# Altium schematic sheet CAN.SchDoc: Radio Pod - CANBUS
size A4; Author: Jonn Dillon
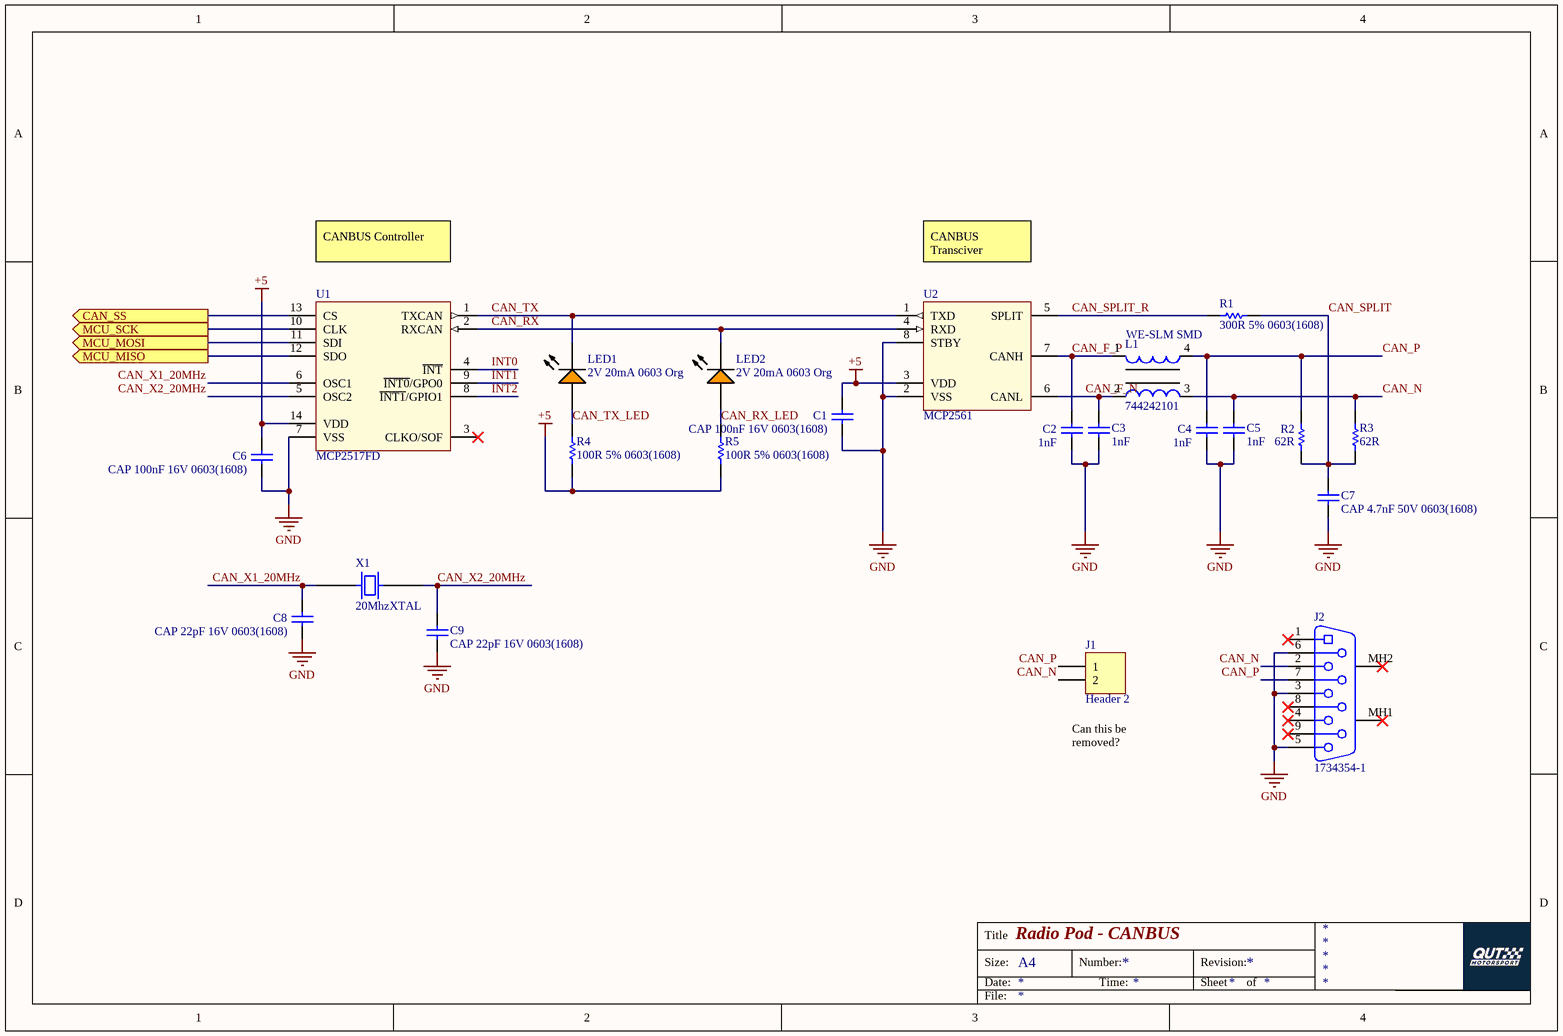
[diagram p0: CAN.SchDoc]

## Parts
C1  CAP 100nF 16V 0603(1608)  [CAPC0603(1608)100_N]
C2  1nF  [CAPC0603(1608)100_M]
C3  1nF  [CAPC0603(1608)100_M]
C4  1nF  [CAPC0603(1608)100_M]
C5  1nF  [CAPC0603(1608)100_M]
C6  CAP 100nF 16V 0603(1608)  [CAPC0603(1608)100_N]
C7  CAP 4.7nF 50V 0603(1608)  [CAPC0603(1608)100_M]
C8  CAP 22pF 16V 0603(1608)  [CAPC0603(1608)100_N]
C9  CAP 22pF 16V 0603(1608)  [CAPC0603(1608)100_N]
J1  Header 2  [HDR1X2]
J2  1734354-1  [TE-1734354-1-9_V]
L1  744242101  [WE-SLM]
LED1  2V 20mA 0603 Org  [KING-LED0603-25-ORANGE_V]
LED2  2V 20mA 0603 Org  [KING-LED0603-25-ORANGE_V]
R1  300R 5% 0603(1608)  [RESC0603(1608)_N]
R2  62R  [RESC1210(3225)_N]
R3  62R  [RESC1210(3225)_N]
R4  100R 5% 0603(1608)  [RESC0603(1608)_L]
R5  100R 5% 0603(1608)  [RESC0603(1608)_L]
U1  MCP2517FD  [MCP2517FD SOIC]
U2  MCP2561  [MCP2561 SOIC]
X1  20MhzXTAL  [HC49]

## Ports
CAN_SS (out), MCU_MISO (out), MCU_MOSI (out), MCU_SCK (out)

## Nets
+5: C1.2 C6.2 R4.2 R5.2 U1.14(VDD) U2.3(VDD)
GND: C1.1 C2.1 C3.1 C4.1 C5.1 C6.1 C7.1 C8.1 C9.2 J2.3 J2.5 J2.6 U1.7(VSS) U2.2(VSS) U2.8(STBY)
CAN_F_N: C3.2 L1.2 U2.6(CANL)
CAN_F_P: C2.2 L1.1 U2.7(CANH)
CAN_N: C5.2 J1.2 J2.2 L1.3 R3.2
CAN_P: C4.2 J1.1 J2.7 L1.4 R2.2
CAN_RX: LED2.2(K) U1.2(RXCAN) U2.4(RXD)
CAN_RX_LED: LED2.1(A) R5.1
CAN_SPLIT: C7.2 R1.2 R2.1 R3.1
CAN_SPLIT_R: R1.1 U2.5(SPLIT)
CAN_SS: U1.13(CS) ; port CAN_SS
CAN_TX: LED1.2(K) U1.1(TXCAN) U2.1(TXD)
CAN_TX_LED: LED1.1(A) R4.1
CAN_X1_20MHz: C8.2 U1.6(OSC1) X1.1
CAN_X2_20MHz: C9.1 U1.5(OSC2) X1.2
INT0: U1.4(~{INT})
INT1: U1.9(~{INT0}/GPO0)
INT2: U1.8(~{INT1}/GPIO1)
MCU_MISO: U1.12(SDO) ; port MCU_MISO
MCU_MOSI: U1.11(SDI) ; port MCU_MOSI
MCU_SCK: U1.10(CLK) ; port MCU_SCK

Not connected (* = marked no-connect by the designer): J2 1* 4* 8* 9* MH1* MH2*; U1 3(CLKO/SOF)*

## Notes on the sheet
- CANBUS Controller
- CANBUS Transciver
- (near L1) WE-SLM SMD
- (near J1) Can this be removed?
- Title
- Size:
- Date:
- A4
- Number:
- Time:
- Revision:
- Sheet
- of
- File:

## Library data of the parts
C1 C6 = CMP-1035-02584-1: CAP 100nF 16V ±10% 0603 (1608 Metric) Thickness 1mm SMD; Tolerance: Â±10%; Case-EIA: 0603; Case-Metric: 1608; Technology: SMT; Max Thickness: 1 mm; Value: 100nF; Rated Voltage: 16 V
C2-C5 = CMP-1035-01878-1: CAP 1nF 16V ±5% 0603 (1608 Metric) Thickness 1mm SMD; Case-Metric: 1608; Case-EIA: 0603; Tolerance: Â±5%; Rated Voltage: 16 V; Max Thickness: 1 mm; Technology: SMT; Value: 1nF
C7 = CMP-1035-02202-1: CAP 4.7nF 50V ±5% 0603 (1608 Metric) Thickness 1mm SMD; Case-Metric: 1608; Case-EIA: 0603; Tolerance: Â±5%; Value: 4.7nF; Rated Voltage: 50 V; Technology: SMT; Max Thickness: 1 mm
C8 C9 = CMP-1035-00808-1: CAP 22pF 16V ±5% 0603 (1608 Metric) Thickness 1mm SMD; Tolerance: Â±5%; Case-EIA: 0603; Case-Metric: 1608; Technology: SMT; Value: 22pF; Rated Voltage: 16 V; Max Thickness: 1 mm
J1 = Header 2: Header, 2-Pin; LatestRevisionDate: 17-Jul-2002; LatestRevisionNote: Re-released for DXP Platform.; Publisher: Altium Limited
J2 = CMP-2000-05403-1: D-Subminiature Socket, Pitch 1.385 mm, 9 Position, Height 12.5 mm, Tail Length 3.2 mm, RoHS, Tray; Manufacturer: TE Connectivity; Connector Type: Receptacle,FemaleSockets; Number of Positions: 9; Connector Style: D-Sub; Catalog Drawings: AMPD-SubMale.318; 3D Model: 1734354-1.pdf; Flange Feature: MatingSide;FemaleScrewlock(4-40); Other Names: A35107; Current Rating: 2A; Voltage Rating: 250V; Mating Products: AML09B-ND / -CONND-SUBPLUG9POSGOLD; Featured Product: AMPLIMITED-SubminiatureConnectors; Product Training Modules: AMPLIMITED-SubConnectors; Dynamic Catalog: AMPLIMITEHD-20Series; Manufacturer URL: http://www.te.com/; Number of Rows: 2; Contact Type: Signal; RoHS Information: 1734354-1StatementofCompliance; Datasheet URL: http://www.te.com.cn/chn-zh/search.html?q=1734354-1&source=header#pdp-optional-registration; Features: BoardLock; Standard Package: 90; Family: D-SubConnectors; Datasheet Version: Rev. A1, 03/2011; Shell Material, Finish: Steel,NickelPlated; Color: Black; Contact Finish Thickness: Flash; Shell Size, Connector Layout: 1(DE,E); Mounting Type: ThroughHole,RightAngle; Contact Finish: Gold; Termination: Solder; Housing Material: Polyamide(PA9T),Nylon9T,GlassFilled; Operating Temperature: -55degC~105degC; Category: Connectors,Interconnects; Series: AMPLIMITEHD-20
L1 = CMP-0222-00021-1: SMD Common Mode Line Filter WE-SLM, L = 100 µH; Inductance: 100 ÂµH; ComponentLink1Description: Manufacturer Link; ComponentLink2URL: http://www.we-online.de/katalog/media/pdf/744242101.pdf; PackageVersion: 2006; PackageReference: WE-SLM; PackageDescription: SMD Inductor, 4-Leads, Body 3.6 x 6.3 mm; ComponentLink1URL: http://www.we-online.com; ComponentLink2Description: Datasheet; DatasheetVersion: ver 3, Feb-2006
LED1 LED2 = CMP-0239-00002-1: LED, SMT, 0603(1608), 0.25mm Tthickness, Super Bright Orange; PartNumber: APG1608SEKC/T; Forward Current: 30 mA; Power Dissipation: 75 mW; Reverse Voltage: 5 V; Packing: Reel; PackageDescription: 2-Pin SMT LED, 1.6 x 0.8 mm Body, 0.25mm Thickness; ComponentLink1URL: http://www.kingbrightusa.com/; PackageVersion: Rev. 4A, 12/2011; Storage Temperature: -40 to 85 degC; Mounting Technology: Surface Mount; ComponentLink2Description: Datasheet; DatasheetVersion: Rev. 4A, 12/2011; ComponentLink2URL: http://www.kingbrightusa.com/images/catalog/SPEC/APG1608SEKC-T.pdf; PackageReference: LED0603-25-ORANGE; ComponentLink1Description: Manufacturer URL
R1 = CMP-1012-00061-1: 300R 0.1W 5% 0603 (1608 Metric)  SMD; Case-EIA: 0603; Value: 300.00 Ohm; Case-Metric: 1608; Tolerance: 5 %; Power: 0.1 W; Technology: SMT
R2 R3 = CMP-1015-00045-1: 62R 0.5W 5% 1210 (3225 Metric)  SMD; Case-EIA: 1210; Value: 62.00 Ohm; Case-Metric: 3225; Technology: SMT; Power: 0.5 W; Tolerance: 5 %
R4 R5 = CMP-1012-00050-1: 100R 0.1W 5% 0603 (1608 Metric)  SMD; Case-EIA: 0603; Value: 100.00 Ohm; Case-Metric: 1608; Tolerance: 5 %; Technology: SMT; Power: 0.1 W
X1 = Crystral 20Mhz